# Altium schematic sheet Sense Clock Ckt.SchDoc: Sense Clock Ckt
size OrCAD A; Engineer: Jack Walker; DocumentNumber: LM-003; Revision: 3; SheetNumber: 3; SheetTotal: 11
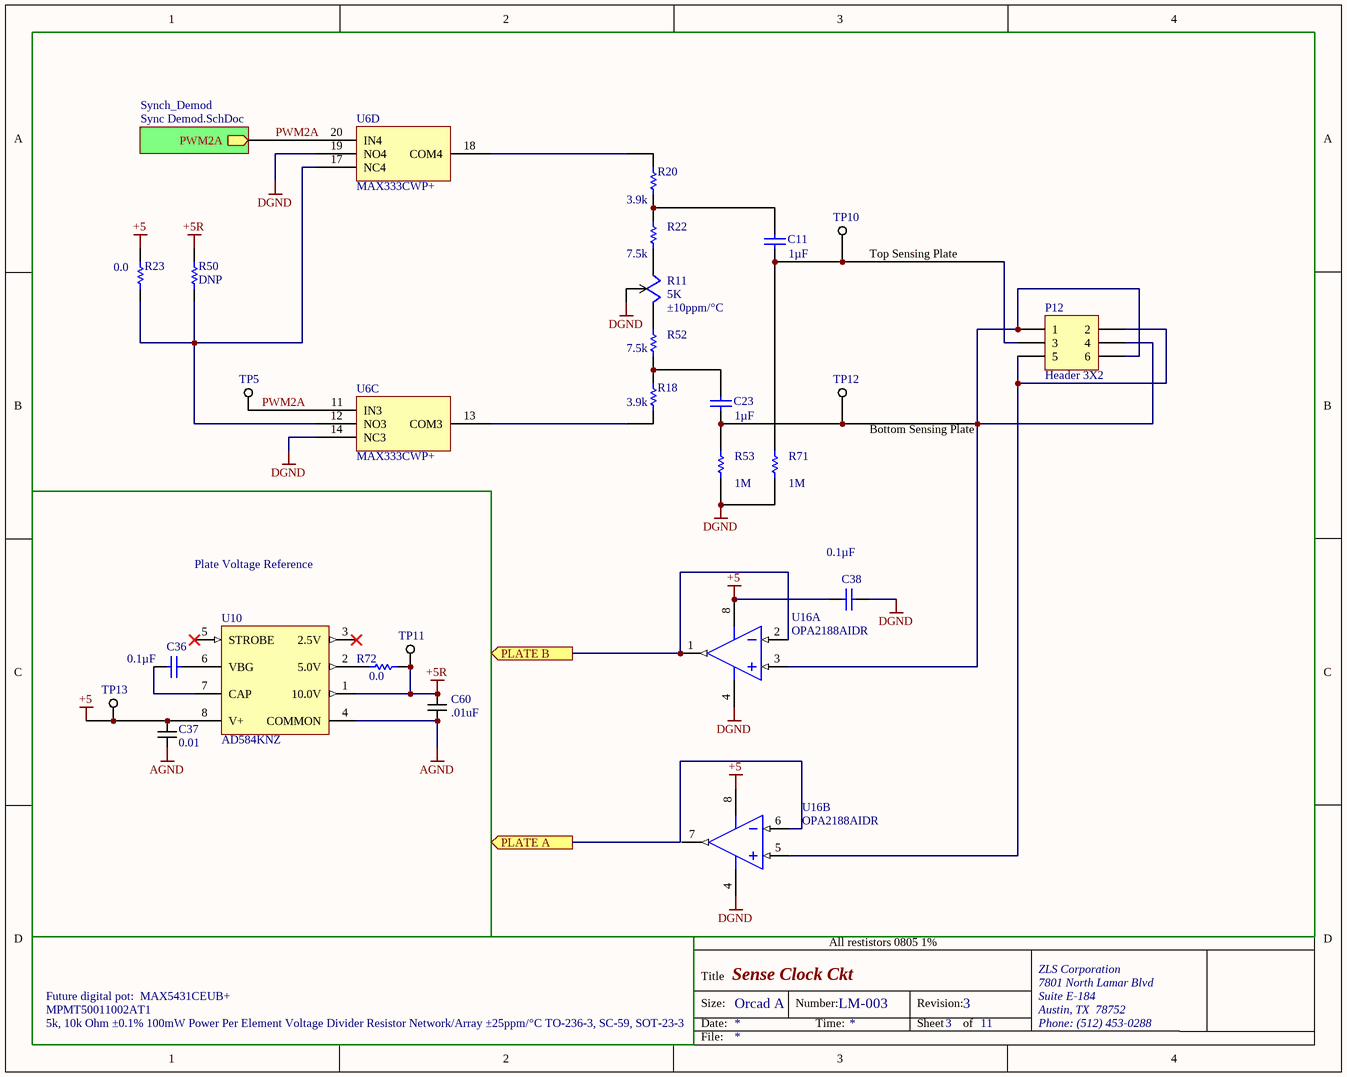
[diagram p0: Sense Clock Ckt.SchDoc]

## Parts
C11  Capacitance: 1µF  [CAPC0805(2012)155_L]  (hidden comment: CAP CER 1UF 25V X7R 0805)
C23  Capacitance: 1µF  [CAPC0805(2012)155_L]  (hidden comment: CAP CER 1UF 25V X7R 0805)
C36  Capacitance: 0.1µF  [CAPC0805(2012)100_N]  (hidden comment: CAP 100nF 25V 0805(2012))
C37  0.01  [RAD-0.1]
C38  Capacitance: 0.1µF  [CAPC0805(2012)155_L]  (hidden comment: CAP CER 0.1UF 25V X7R 0805)
C60  .01uF
P12  Header 3X2
R11  5K  Temperature Coefficient: ±10ppm/°C
R18  Resistance (Ohms): 3.9k  [RESC0805(2012)_N]  (hidden comment: RES SMD 3.9K OHM 5% 1/8W 0805)
R20  Resistance (Ohms): 3.9k  [RESC0805(2012)_N]  (hidden comment: RES SMD 3.9K OHM 5% 1/8W 0805)
R22  Resistance (Ohms): 7.5k  [RESC0805(2012)_N]  (hidden comment: RES SMD 7.5K OHM 1% 1/8W 0805)
R23  Resistance (Ohms): 0.0  [RESC0805(2012)_M]  (hidden comment: RES SMD 0.0 OHM JUMPER 1/8W 0805)
R50  DNP  [RESC0805(2012)_M]
R52  Resistance (Ohms): 7.5k  [RESC0805(2012)_N]  (hidden comment: RES SMD 7.5K OHM 1% 1/8W 0805)
R53  Resistance (Ohms): 1M  [RESC0805(2012)_N]  (hidden comment: RES SMD 1M OHM 1% 1/8W 0805)
R71  Resistance (Ohms): 1M  [RESC0805(2012)_N]  (hidden comment: RES SMD 1M OHM 1% 1/8W 0805)
R72  Resistance (Ohms): 0.0  [RESC0805(2012)_M]  (hidden comment: RES SMD 0.0 OHM JUMPER 1/8W 0805)
TP5  (no value)
TP10  (no value)
TP11  (no value)  [TESTPOINT .45]
TP12  (no value)
TP13  (no value)  [TESTPOINT .45]
U6  MAX333CWP+  (parts C,D of 4)
U10  AD584KNZ  [ADI-N-8]
U16  OPA2188AIDR  [D0008A_L]  (parts A,B of 2)

## Blocks framed on the sheet
Plate Voltage Reference: C36 C37 C60 R72 TP11 TP13 U10

## Sub-sheets
Synch_Demod = Sync Demod.SchDoc: PWM2A (out)

## Ports
PLATE A (out), PLATE B (out)

## Nets
+5: C37.1 C38.1 R23.2 TP13.1 U10.8(V+) U16.8(V+)
+5R: C60.1 R50.2 R72.1 TP11.1 U10.1(10.0V)
AGND: C37.2 C60.2 U10.4(COMMON)
DGND: C38.2 R11.3 R53.1 R71.1 U6.14(NC3) U6.19(NO4) U16.4(V-)
PLATE A: U16.6(IN_B-) ; port PLATE A
PLATE B: U16.1(OUT_A) U16.2(IN_A-) ; port PLATE B
PWM2A: TP5.1 U6.11(IN3) U6.20(IN4) ; sheet Synch_Demod/PWM2A
NetC11_1: C11.1 P12.3 R71.2 TP10.1
NetC11_2: C11.2 R20.1 R22.2
NetC23_1: C23.1 P12.1 P12.4 P12.6 R53.2 TP12.1 U16.3(IN_A+)
NetC23_2: C23.2 R18.2 R52.1
NetC36_1: C36.1 U10.7(CAP)
NetC36_2: C36.2 U10.6(VBG)
NetP12_2: P12.2 P12.5 U16.5(IN_B+)
NetR11_1: R11.1 R22.1
NetR11_2: R11.2 R52.2
NetR18_1: R18.1 U6.13(COM3)
NetR20_2: R20.2 U6.18(COM4)
NetR23_1: R23.1 R50.1 U6.12(NO3) U6.17(NC4)
NetR72_2: R72.2 U10.2(5.0V)

Not connected (* = marked no-connect by the designer): U6 15(N/C); U10 3(2.5V)* 5(STROBE)*; U16 7(OUT_B)

## Notes on the sheet
- (near TP10) Top Sensing Plate
- (near TP12) Bottom Sensing Plate
- All restistors 0805 1%
- MPMT50011002AT1
- 5k, 10k Ohm ±0.1% 100mW Power Per Element Voltage Divider Resistor Network/Array ±25ppm/°C TO-236-3, SC-59, SOT-23-3
- Future digital pot:  MAX5431CEUB+
- Title
- Size:
- Date:
- Orcad A
- Number:
- Time:
- Revision:
- Sheet
- of
- ZLS Corporation
- 7801 North Lamar Blvd
- Suite E-184
- Austin, TX  78752
- Phone: (512) 453-0288
- File:

## Library data of the parts
C11 C23 = CMP-1036-04882-1: Manufacturer: Murata Electronics North America; Manufacturer Part Number: GRM21BR71E105KA99L; Tolerance: ±10%; Supplier 1: Digi-Key; Supplier Part Number 1: 490-6484-6-ND; RoHS: RoHS Compliant; Description: CAP CER 1UF 25V X7R 0805; Category: Capacitors; Stock 1: 295074; Pricing 1: 1=0.14, 10=0.099, 100=0.0468, 500=0.0328, 1000=0.02715 (USD); Packaging: Digi-Reel®; Part Status: Active; Voltage - Rated: 25V; Temperature Coefficient: X7R; Operating Temperature: -55°C ~ 125°C; Features: -; Ratings: -; Applications: General Purpose; Mounting Type: Surface Mount, MLCC; Package / Case: 0805 (2012 Metric); Size / Dimension: 0.079" L x 0.049" W (2.00mm x 1.25mm); Height - Seated (Max): -; Thickness (Max): 0.053" (1.35mm); Lead Spacing: -; Lead Style: -; ComponentLink1URL: http://www.murata.com/~/media/webrenewal/support/library/catalog/products/capacitor/mlcc/c02e.ashx; ComponentLink1Description: http://www.murata.com/~/media/webrenewal/support/library/catalog/products/capacitor/mlcc/c02e.ashx
C36 = CMP-1036-04416-1: CAP 100nF 25V -20% to +80% 0805 (2012 Metric) Thickness 1mm SMD; Manufacturer: Murata Electronics North America; Manufacturer Part Number: GRM21BR71E104KA01L; Tolerance: ±10%; Temperature Coefficient: X7R; Supplier 1: Digi-Key; Supplier Part Number 1: 490-1673-1-ND; RoHS: RoHS Compliant; Category: Capacitors; Stock 1: 895391; Pricing 1: 1=0.2, 10=0.145, 100=0.0683, 500=0.04788, 1000=0.03964 (USD); Packaging: Cut Tape (CT); Part Status: Active; Voltage - Rated: 25V; Operating Temperature: -55°C ~ 125°C; Features: -; Ratings: -; Applications: General Purpose; Mounting Type: Surface Mount, MLCC; Package / Case: 0805 (2012 Metric); Size / Dimension: 0.079" L x 0.049" W (2.00mm x 1.25mm); Height - Seated (Max): -; Thickness (Max): 0.053" (1.35mm); Lead Spacing: -; Lead Style: -; ComponentLink1URL: http://www.murata.com/~/media/webrenewal/support/library/catalog/products/capacitor/mlcc/c02e.ashx; ComponentLink1Description: http://www.murata.com/~/media/webrenewal/support/library/catalog/products/capacitor/mlcc/c02e.ashx
C37 = CAP B: CAP CER 10000PF 50V 10% X7R 0402; Manufacturer 1: Murata Electronics North America; Manufacturer Part Number 1: GRM155R71H103KA88D; Category 1: Capacitors; Supplier 1: Digi-Key; Supplier Part Number 1: 490-4516-2-ND; RoHS 1: RoHS Compliant; Description 1: CAP CER 10000PF 50V 10% X7R 0402; Stock 1: 652600; Pricing 1: 10000=0.00372, 20000=0.00354, 30000=0.00336, 50000=0.00301, 100000=0.00243 (USD); Packaging: Tape & Reel (TR); Capacitance: 10000pF; Tolerance: ±10%; Voltage - Rated: 50V; Temperature Coefficient: X7R; Mounting Type: Surface Mount, MLCC; Operating Temperature: -55°C ~ 125°C; Applications: General Purpose; Ratings: -; Package / Case: 0402 (1005 Metric); Size / Dimension: 0.039" L x 0.020" W (1.00mm x 0.50mm); Height - Seated (Max): -; Thickness (Max): 0.022" (0.55mm); Lead Spacing: -; Features: -; Lead Style: -; ComponentLink1URL: http://www.murata.com/products/catalog/pdf/c02e.pdf; ComponentLink1Description: http://www.murata.com/products/catalog/pdf/c02e.pdf
C38 = CMP-1036-04882-1: Manufacturer: Murata Electronics North America; Manufacturer Part Number: GRM21BR71E104KA01L; Tolerance: ±10%; Supplier 1: Digi-Key; Supplier Part Number 1: 490-1673-6-ND; RoHS: RoHS Compliant; Description: CAP CER 0.1UF 25V X7R 0805; Category: Capacitors; Stock 1: 891652; Pricing 1: 1=0.2, 10=0.145, 100=0.0683, 500=0.04788, 1000=0.03964 (USD); Packaging: Digi-Reel®; Part Status: Active; Voltage - Rated: 25V; Temperature Coefficient: X7R; Operating Temperature: -55°C ~ 125°C; Features: -; Ratings: -; Applications: General Purpose; Mounting Type: Surface Mount, MLCC; Package / Case: 0805 (2012 Metric); Size / Dimension: 0.079" L x 0.049" W (2.00mm x 1.25mm); Height - Seated (Max): -; Thickness (Max): 0.053" (1.35mm); Lead Spacing: -; Lead Style: -; ComponentLink1URL: http://www.murata.com/~/media/webrenewal/support/library/catalog/products/capacitor/mlcc/c02e.ashx; ComponentLink1Description: http://www.murata.com/~/media/webrenewal/support/library/catalog/products/capacitor/mlcc/c02e.ashx
C60 = CAP B: CAP CER 10000PF 50V X7R 0805; Manufacturer 1: Murata Electronics North America; Manufacturer Part Number 1: GRM216R71H103KA01D; Category 1: Capacitors; Tolerance: ±10%; Supplier 1: Digi-Key; Supplier Part Number 1: 490-1664-1-ND; RoHS 1: RoHS Compliant; Description 1: CAP CER 10000PF 50V X7R 0805; Stock 1: 1003025; Pricing 1: 1=0.1, 10=0.072, 25=0.052, 50=0.0392, 100=0.032, 250=0.02672, 500=0.02282, 1000=0.01793 (USD); Packaging: Cut Tape (CT); Part Status: Active; Capacitance: 10000pF; Voltage - Rated: 50V; Temperature Coefficient: X7R; Operating Temperature: -55°C ~ 125°C; Features: -; Ratings: -; Applications: General Purpose; Mounting Type: Surface Mount, MLCC; Package / Case: 0805 (2012 Metric); Size / Dimension: 0.079" L x 0.049" W (2.00mm x 1.25mm); Height - Seated (Max): -; Thickness (Max): 0.028" (0.70mm); Lead Spacing: -; Lead Style: -; ComponentLink1URL: http://www.murata.com/~/media/webrenewal/support/library/catalog/products/capacitor/mlcc/c02e.ashx; ComponentLink1Description: http://www.murata.com/~/media/webrenewal/support/library/catalog/products/capacitor/mlcc/c02e.ashx
P12 = Header 3X2: Header, 3-Pin, Dual row; Manufacturer 1: Amphenol FCI; Manufacturer Part Number 1: 861400062YO2LF; Description 1: HEADER BERGSTIK; Category 1: Connectors, Interconnects; Pitch - Mating: 0.100" (2.54mm); Style: Board to Board or Cable; Shrouding: Unshrouded; Number of Positions: 6; Number of Positions Loaded: All; Contact Length - Mating: 0.276" (7.00mm); Contact Length - Post: 0.118" (3.00mm); Overall Contact Length: 0.496" (12.60mm); Material Flammability Rating: UL94 V-0; Current Rating: 3A; Voltage Rating: 1000V; Supplier 1: Digi-Key; Supplier Part Number 1: 861400062YO2LF-ND; RoHS 1: RoHS Compliant; Stock 1: 0; Pricing 1: 6000=0.09952 (USD); Packaging: Bulk; Part Status: Active; Connector Type: Header; Contact Type: Male Pin; Number of Rows: 2; Row Spacing - Mating: 0.100" (2.54mm); Mounting Type: Through Hole; Termination: Solder; Fastening Type: -; Insulation Height: 0.102" (2.60mm); Contact Shape: Square; Contact Finish - Mating: Gold or Gold, GXT™; Contact Finish Thickness - Mating: 8µin (0.20µm); Contact Finish - Post: -; Contact Material: Copper Alloy; Insulation Material: Thermoplastic; Features: -; Operating Temperature: -55°C ~ 125°C; Ingress Protection: -; Insulation Color: -; Mated Stacking Heights: -; Contact Finish Thickness - Post: -; Applications: -; ComponentLink1URL: http://portal.fciconnect.com/Comergent//fci/drawing/c-8614-0086.pdf; ComponentLink1Description: http://portal.fciconnect.com/Comergent//fci/drawing/c-8614-0086.pdf
R11 = RES1, CENTER TAP: TRIMMER 5K OHM 0.25W PC PIN; Manufacturer 1: Vishay Foil Resistors (Division of Vishay Precision Group); Manufacturer Part Number 1: Y00535K00000J0L; Category 1: Potentiometers, Variable Resistors; Power (Watts): 0.25W, 1/4W; Tolerance: ±5%; Number of Turns: 21; Adjustment Type: Side Adjustment; Resistive Material: Metal Foil; Supplier 1: Digi-Key; Supplier Part Number 1: 804-1020-ND; RoHS 1: RoHS Compliant; Description 1: TRIMMER 5K OHM 0.25W PC PIN; Stock 1: 679; Pricing 1: 1=34.42, 10=32.265, 25=26.5292, 50=22.944, 100=22.227, 250=20.793, 500=19.2156 (USD); Packaging: Bulk; Part Status: Active; Resistance (Ohms): 5k; Mounting Type: Through Hole; Termination Style: PC Pins; Size / Dimension: Rectangular - 0.250" x 0.175" Face x 0.250" L (6.35mm x 4.45mm x 6.35mm); ComponentLink1URL: http://www.vishaypg.com/docs/63053/1240.pdf; ComponentLink1Description: http://www.vishaypg.com/docs/63053/1240.pdf
R18 R20 = CMP-1013-00606-1: Manufacturer: Vishay Dale; Manufacturer Part Number: CRCW08053K90JNEA; Power (Watts): 0.125W, 1/8W; Temperature Coefficient: ±200ppm/°C; Supplier 1: Digi-Key; Supplier Part Number 1: 541-3.9KADKR-ND; RoHS: RoHS Compliant; Description: RES SMD 3.9K OHM 5% 1/8W 0805; Category: Resistors; Stock 1: 20963; Pricing 1: 1=0.1, 10=0.028, 100=0.0114, 1000=0.00513, 2500=0.00445 (USD); Packaging: Digi-Reel®; Part Status: Active; Tolerance: ±5%; Composition: Thick Film; Features: Automotive AEC-Q200; Operating Temperature: -55°C ~ 155°C; Package / Case: 0805 (2012 Metric); Supplier Device Package: 0805; Size / Dimension: 0.079" L x 0.049" W (2.00mm x 1.25mm); Height - Seated (Max): 0.020" (0.50mm); Failure Rate: -; ComponentLink1URL: http://www.vishay.com/docs/20035/dcrcwe3.pdf; ComponentLink1Description: http://www.vishay.com/docs/20035/dcrcwe3.pdf
R22 R52 = CMP-1013-00606-1: Manufacturer: Vishay Dale; Manufacturer Part Number: CRCW08057K50FKEA; Power (Watts): 0.125W, 1/8W; Temperature Coefficient: ±100ppm/°C; Supplier 1: Digi-Key; Supplier Part Number 1: 541-7.50KCDKR-ND; RoHS: RoHS Compliant; Category: Resistors; Stock 1: 0; Pricing 1: 1=0.1, 10=0.044, 100=0.0178, 1000=0.00802, 2500=0.00696 (USD); Packaging: Digi-Reel®; Part Status: Active; Tolerance: ±1%; Composition: Thick Film; Features: Automotive AEC-Q200; Operating Temperature: -55°C ~ 155°C; Package / Case: 0805 (2012 Metric); Supplier Device Package: 0805; Size / Dimension: 0.079" L x 0.049" W (2.00mm x 1.25mm); Height - Seated (Max): 0.020" (0.50mm); Failure Rate: -; ComponentLink1URL: http://www.vishay.com/docs/20035/dcrcwe3.pdf; ComponentLink1Description: http://www.vishay.com/docs/20035/dcrcwe3.pdf
R23 R72 = CMP-1013-00017-1: Manufacturer: Vishay Dale; Manufacturer Part Number: CRCW08050000Z0EA; Power (Watts): 0.125W, 1/8W; Supplier 1: Digi-Key; Supplier Part Number 1: 541-0.0ADKR-ND; RoHS: RoHS Compliant; Category: Resistors; Stock 1: 407603; Pricing 1: 1=0.1, 10=0.026, 25=0.0184, 50=0.014, 100=0.0104, 250=0.00792, 500=0.00634, 1000=0.00466 (USD); Packaging: Digi-Reel®; Part Status: Active; Tolerance: Jumper; Composition: Thick Film; Features: Automotive AEC-Q200; Temperature Coefficient: -; Operating Temperature: -55°C ~ 155°C; Package / Case: 0805 (2012 Metric); Supplier Device Package: 0805; Size / Dimension: 0.079" L x 0.049" W (2.00mm x 1.25mm); Height - Seated (Max): 0.020" (0.50mm); Failure Rate: -; ComponentLink1URL: http://www.vishay.com/docs/20035/dcrcwe3.pdf; ComponentLink1Description: http://www.vishay.com/docs/20035/dcrcwe3.pdf
R50 = CMP-1013-00017-1: RES SMD 0.0 OHM JUMPER 1/8W 0805; Manufacturer: Vishay Dale; Manufacturer Part Number: CRCW08050000Z0EA; Resistance (Ohms): 0.0; Power (Watts): 0.125W, 1/8W; Supplier 1: Digi-Key; Supplier Part Number 1: 541-0.0ADKR-ND; RoHS: RoHS Compliant; Category: Resistors; Stock 1: 407603; Pricing 1: 1=0.1, 10=0.026, 25=0.0184, 50=0.014, 100=0.0104, 250=0.00792, 500=0.00634, 1000=0.00466 (USD); Packaging: Digi-Reel®; Part Status: Active; Tolerance: Jumper; Composition: Thick Film; Features: Automotive AEC-Q200; Temperature Coefficient: -; Operating Temperature: -55°C ~ 155°C; Package / Case: 0805 (2012 Metric); Supplier Device Package: 0805; Size / Dimension: 0.079" L x 0.049" W (2.00mm x 1.25mm); Height - Seated (Max): 0.020" (0.50mm); Failure Rate: -; ComponentLink1URL: http://www.vishay.com/docs/20035/dcrcwe3.pdf; ComponentLink1Description: http://www.vishay.com/docs/20035/dcrcwe3.pdf
R53 R71 = CMP-1013-00606-1: Manufacturer: Vishay Dale; Manufacturer Part Number: CRCW08051M00FKEA; Power (Watts): 0.125W, 1/8W; Temperature Coefficient: ±100ppm/°C; Supplier 1: Digi-Key; Supplier Part Number 1: 541-1.00MCDKR-ND; RoHS: RoHS Compliant; Category: Resistors; Stock 1: 44065; Pricing 1: 1=0.1, 10=0.044, 100=0.0178, 1000=0.00802, 2500=0.00696 (USD); Packaging: Digi-Reel®; Part Status: Active; Tolerance: ±1%; Composition: Thick Film; Features: Automotive AEC-Q200; Operating Temperature: -55°C ~ 155°C; Package / Case: 0805 (2012 Metric); Supplier Device Package: 0805; Size / Dimension: 0.079" L x 0.049" W (2.00mm x 1.25mm); Height - Seated (Max): 0.020" (0.50mm); Failure Rate: -; ComponentLink1URL: http://www.vishay.com/docs/20035/dcrcwe3.pdf; ComponentLink1Description: http://www.vishay.com/docs/20035/dcrcwe3.pdf
TP5 TP10 TP12 = TESTPOINT A: TEST POINT PC MINI .040"D BLACK; Manufacturer 1: Keystone Electronics; Manufacturer Part Number 1: 5001; Category 1: Test and Measurement; Plating: Silver; Material - Insulation: Nylon 46, UL 94V-0; Material - Body: Phosphor Bronze; Supplier 1: Digi-Key; Supplier Part Number 1: 36-5001-ND; RoHS 1: RoHS Compliant; Description 1: TEST POINT PC MINI .040"D BLACK; Stock 1: 883882; Pricing 1: 1=0.37, 10=0.316, 50=0.2298, 100=0.2209, 250=0.19832, 500=0.18932, 1000=0.1616, 2500=0.14424, 5000=0.13523 (USD); Packaging: Bulk; Part Status: Active; Type: PC Test Point, Miniature; Mounting Type: 0.040" (1.02mm) Hole Diameter; Color: Black; Size / Dimension: 0.100" Dia x 0.180" L (2.54mm x 4.57mm); Height: -; ComponentLink1URL: http://www.keyelco.com/product-pdf.cfm?p=1310; ComponentLink1Description: http://www.keyelco.com/product-pdf.cfm?p=1310
TP11 TP13 = TESTPOINT A
U10 = CMP-0784-00054-1: Pin Programmable, Precision Voltage Reference, + 2.5 / + 5 / + 7.5 / + 10 Prog V Output, 4.5 to 30 V Supply, Commercial, 8-pin DIP (N-8), Tube; Manufacturer: Analog Devices; Max V Supply (V): 30; Min V Supply (V): 4.5; Ref Out TC (ppm/C): 15; Vout: 2.5V, 5V, 7.5V, 10V; ComponentLink3URL: http:/www.analog.com/static/imported-files/packages/PKG_PDF/PDIP(N)/N_8.pdf; ComponentLink1URL: http://www.analog.com/en/index.html; PartNumber: AD584KNZ; ComponentLink1Description: Manufacturer URL; ComponentLink2Description: Datasheet; PackageDescription: 8-Pin Plastic Dual In-Line Package, Row spacing 7.62 mm, Pitch 2.54 mm; Operating Temp Range: 0 to 70 degC; DatasheetVersion: Rev. C; Code_JEDEC: MS-001; Packing: Tube; ComponentLink3Description: Package Specification; PackageReference: N-8; ComponentLink4Description: URL Link1; Mounting Technology: Through Hole; PackageVersion: 070606-A, 07/2006; ComponentLink4URL: Product URL:http://www.analog.com/en/special-linear-functions/voltage-references/ad584/products/product.html; ComponentLink2URL: http://www.analog.com/static/imported-files/data_sheets/AD584.pdf
U16 = CMP-0272-00241-3: 0.03 uV/degC, 6 uV Vos, Low Noise, Rail-to-Rail Output, Zero-Drift Operational Amplifier, 4 to 36 V, -40 to 105 degC, 8-pin SOIC (D8), Green (RoHS & no Sb/Br); Manufacturer: Texas Instruments; Number of Circuits: 2; Slew Rate: 0.8 V/µs; Current - Supply: 415µA; Current - Output / Channel: 18mA; Voltage - Supply, Single/Dual (±): 4 V ~ 36 V, ±2 V ~ 18 V; Supplier 1: Digi-Key; Supplier Part Number 1: 296-29454-6-ND; Manufacturer Part Number: OPA2188AIDR; RoHS: RoHS Compliant; Category: Integrated Circuits (ICs); Stock 1: 8272; Pricing 1: 1=3.44, 10=3.089, 100=2.5307, 500=2.15434, 1000=1.81692 (USD); Packaging: Digi-Reel®; Part Status: Active; Amplifier Type: Zero-Drift; Output Type: Rail-to-Rail; -3db Bandwidth: -; Operating Temperature: -40°C ~ 105°C; Mounting Type: Surface Mount; Package / Case: 8-SOIC (0.154", 3.90mm Width); Supplier Device Package: 8-SOIC; ComponentLink1URL: http://www.ti.com/lit/ds/symlink/opa2188.pdf; ComponentLink1Description: http://www.ti.com/lit/ds/symlink/opa2188.pdf